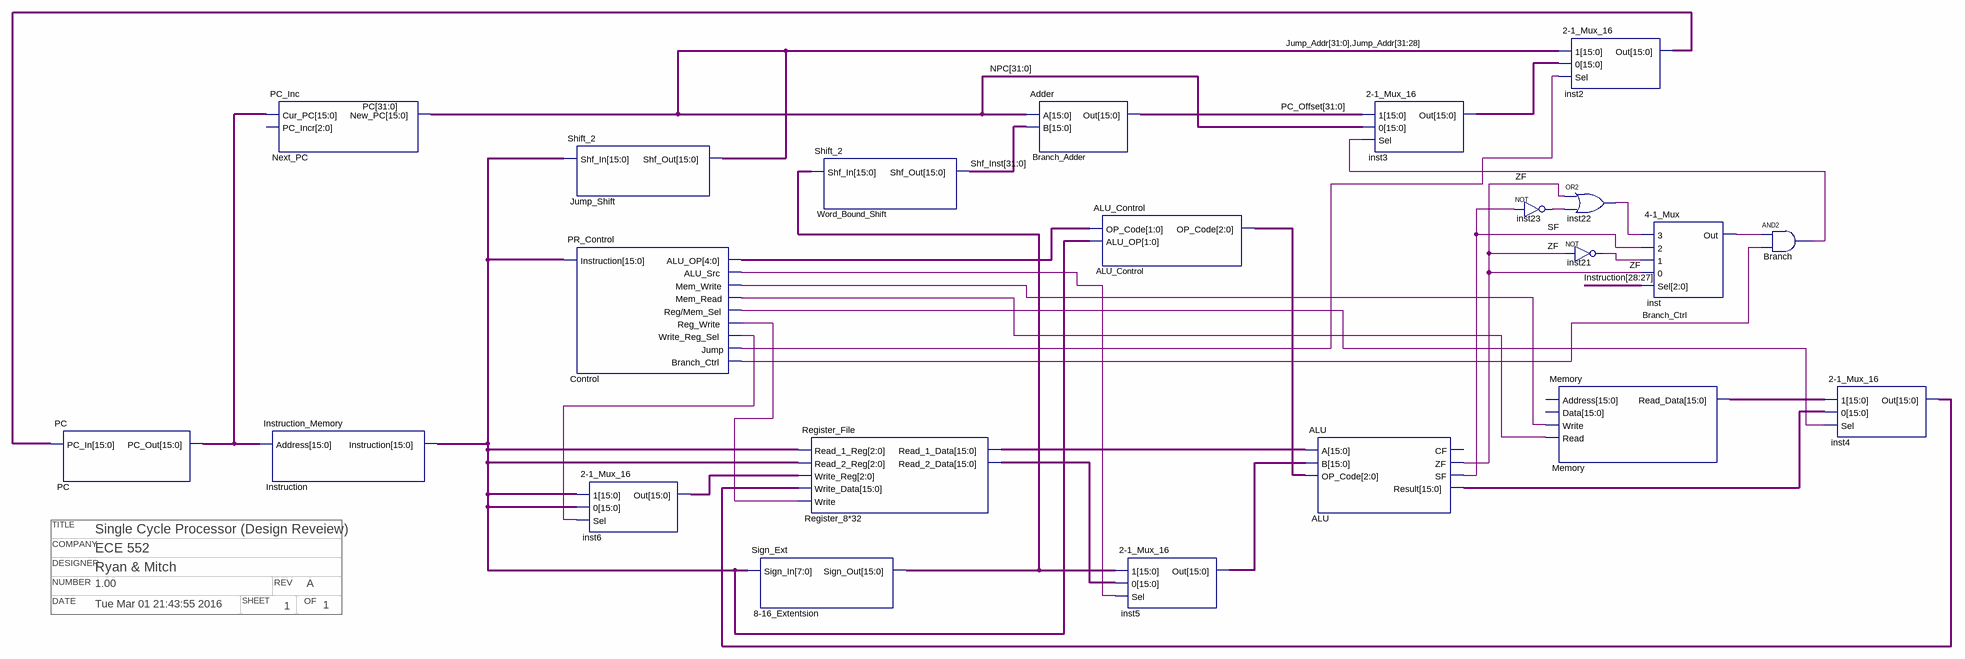
[diagram p0: schematic sheet]
// Quartus schematic Processor.bdf as structural Verilog: 22 symbols, 0 pins
// Title block: TITLE: Single Cycle Processor (Design Reveiew); COMPANY: ECE 552; DESIGNER: Ryan & Mitch; NUMBER: 1.00; REV: A; DATE: Tue Mar 01 21:43:55 2016; SHEET: 1; OF: 1
module Processor (
);

  wire Branch_Ctrl, Branch_out, Control_alu_src, Control_jump, Control_mem_read, Control_mem_write,
       Control_reg_mem_sel, Control_reg_write, Control_write_reg_sel, inst21_out, inst22_out, inst23_out,
       inst_out, SF, ZF;
  wire [2:0] ALU_Control_op_code;
  wire [4:0] Control_alu_op;
  wire [15:0] ALU_result, inst2_out, inst3_out, inst4_out, inst5_out, inst6_out, Instruction_instruction,
       Memory_read_data, n8_16_Extentsion_sign_out, Register_8_32_read_1_data, Register_8_32_read_2_data;
  wire [28:27] Instruction;
  wire [31:0] Jump_Addr, NPC, PC, PC_Offset, Shf_Inst;

  PC u_PC (.PC_In(inst2_out), .PC_Out(PC));
  PC_Inc Next_PC (.Cur_PC(PC), .New_PC({Jump_Addr, Jump_Addr[31:28]}));  // open: PC_Incr
  Instruction_Memory u_Instruction (.Address(PC), .Instruction(Instruction_instruction));
  Shift_2 Jump_Shift (.Shf_In(Instruction_instruction), .Shf_Out({Jump_Addr, Jump_Addr[31:28]}));
  PR_Control Control (
    .Instruction(Instruction_instruction), .ALU_OP(Control_alu_op), .ALU_Src(Control_alu_src),
    .Mem_Write(Control_mem_write), .Mem_Read(Control_mem_read), .\Reg/Mem_Sel (Control_reg_mem_sel),
    .Reg_Write(Control_reg_write), .Write_Reg_Sel(Control_write_reg_sel), .Jump(Control_jump),
    .Branch_Ctrl(Branch_Ctrl));
  \2-1_Mux_16  inst6 (
    .\1 (Instruction_instruction), .\0 (Instruction_instruction), .Sel(Control_write_reg_sel), .Out(inst6_out));
  Sign_Ext \u_8-16_Extentsion  (.Sign_In(Instruction_instruction), .Sign_Out(n8_16_Extentsion_sign_out));
  Shift_2 Word_Bound_Shift (.Shf_In(n8_16_Extentsion_sign_out), .Shf_Out(Shf_Inst));
  Register_File \Register_8*32  (
    .Read_1_Reg(Instruction_instruction), .Read_2_Reg(Instruction_instruction), .Write_Reg(inst6_out),
    .Write_Data(inst4_out), .Write(Control_reg_write), .Read_1_Data(Register_8_32_read_1_data),
    .Read_2_Data(Register_8_32_read_2_data));
  Adder Branch_Adder (.A({Jump_Addr, Jump_Addr[31:28]}), .B(Shf_Inst), .Out(PC_Offset));
  ALU_Control ALU_Control (
    .OP_Code({ALU_Control_op_code[2], 1'bz, ALU_Control_op_code[1], 1'bz, ALU_Control_op_code[0]}),
    .ALU_OP(Instruction_instruction));
  \2-1_Mux_16  inst5 (
    .\1 (n8_16_Extentsion_sign_out), .\0 (Register_8_32_read_2_data), .Sel(Control_alu_src), .Out(inst5_out));
  ALU ALU (
    .A(Register_8_32_read_1_data), .B(inst5_out), .OP_Code(ALU_Control_op_code), .ZF(ZF), .SF(SF),
    .Result(ALU_result));  // open: CF
  \2-1_Mux_16  inst3 (.\1 (PC_Offset), .\0 (NPC), .Sel(Branch_out), .Out(inst3_out));
  not inst23 (inst23_out, SF);
  Memory Memory (
    .Write(Control_mem_write), .Read(Control_mem_read), .Read_Data(Memory_read_data));  // open: Address, Data
  \2-1_Mux_16  inst2 (.\1 ({Jump_Addr, Jump_Addr[31:28]}), .\0 (inst3_out), .Sel(Control_jump), .Out(inst2_out));
  or inst22 (inst22_out, ZF, inst23_out);
  not inst21 (inst21_out, ZF);
  \4-1_Mux  inst (.\3 (inst22_out), .\2 (SF), .\1 (inst21_out), .\0 (ZF), .Sel(Instruction), .Out(inst_out));
  and Branch (Branch_out, inst_out, Branch_Ctrl);
  \2-1_Mux_16  inst4 (.\1 (Memory_read_data), .\0 (ALU_result), .Sel(Control_reg_mem_sel), .Out(inst4_out));
endmodule
